# EAGLE design arm (EAGLE 5.08)
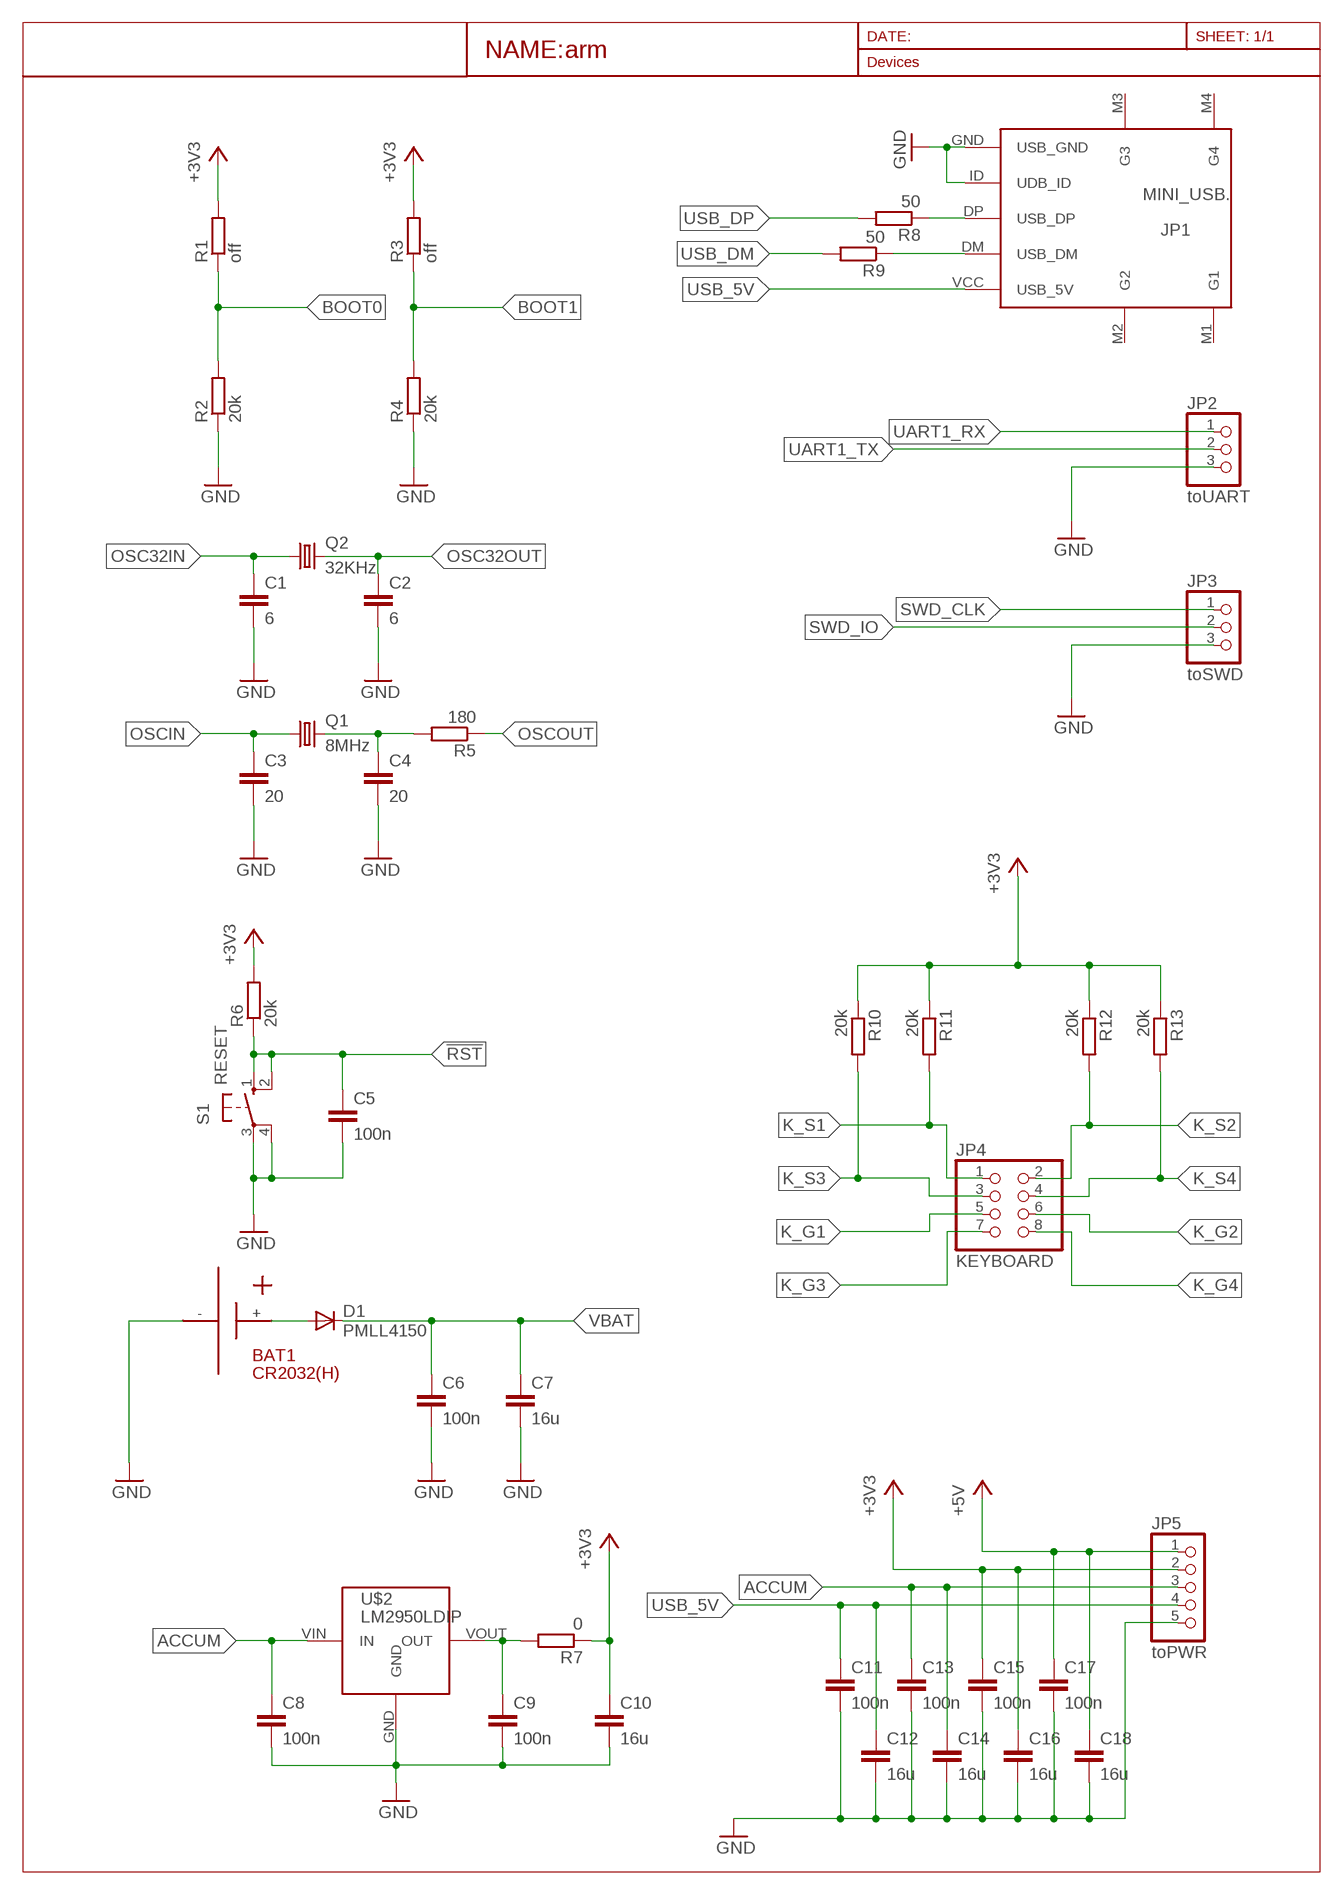
[diagram p0: schematic, sheet 1, part 1 of 2]
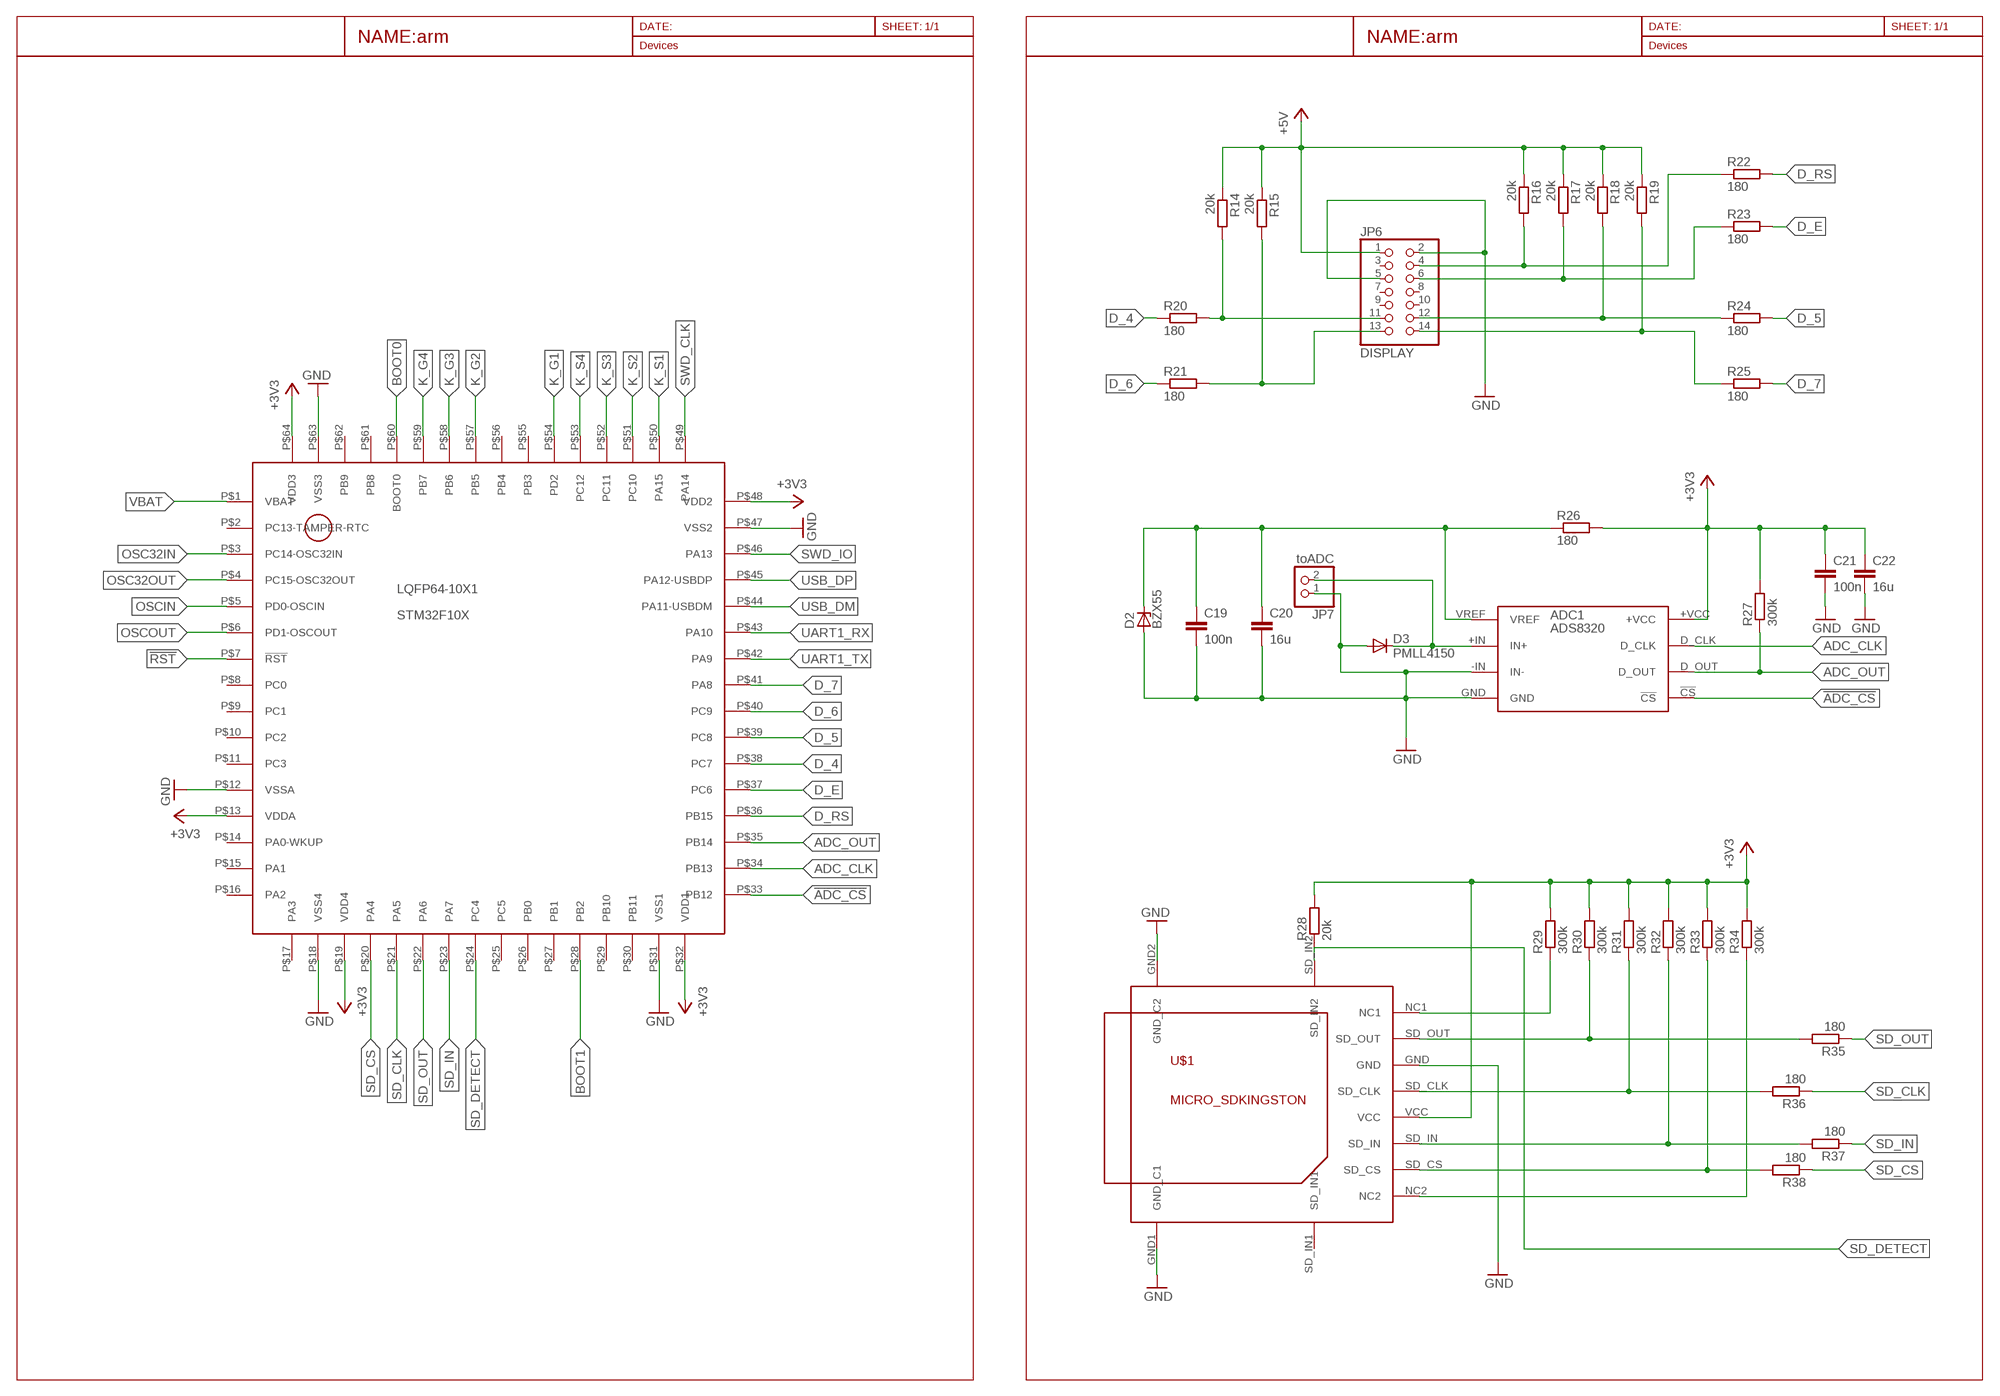
[diagram p1: schematic, sheet 1, part 2 of 2]

## Parts
ADC1  ADS8320  [S-PDSO-G8]
BAT1  CR2032(H)  [BEL/P]
C1  6  C-EUC1206  [C1206]
C2  6  C-EUC1206  [C1206]
C3  20  C-EUC1206  [C1206]
C4  20  C-EUC1206  [C1206]
C5  100n  C-EUC1206  [C1206]
C6  100n  C-EUC1206  [C1206]
C7  16u  C-EU025-024X044  [C025-024X044]
C8  100n  C-EUC1206  [C1206]
C9  100n  C-EUC1206  [C1206]
C10  16u  C-EU025-024X044  [C025-024X044]
C11  100n  C-EUC1206  [C1206]
C12  16u  C-EU025-024X044  [C025-024X044]
C13  100n  C-EUC1206  [C1206]
C14  16u  C-EU025-024X044  [C025-024X044]
C15  100n  C-EUC1206  [C1206]
C16  16u  C-EU025-024X044  [C025-024X044]
C17  100n  C-EUC1206  [C1206]
C18  16u  C-EU025-024X044  [C025-024X044]
C19  100n  C-EUC1206  [C1206]
C20  16u  C-EU025-024X044  [C025-024X044]
C21  100n  C-EUC1206  [C1206]
C22  16u  C-EU025-024X044  [C025-024X044]
D1  PMLL4150  [SOD80C]
D2  BZX55  [DO35Z10]
D3  PMLL4150  [SOD80C]
JP1  MINI_USB.  [32005-201]
JP2  toUART  PINHD-1X3  [1X03]
JP3  toSWD  PINHD-1X3  [1X03]
JP4  KEYBOARD  PINHD-2X4  [2X04]
JP5  toPWR  PINHD-1X5  [1X05]
JP6  DISPLAY  PINHD-2X7  [2X07]
JP7  toADC  PINHD-1X2  [1X02]
LQFP64-10X1  STM32F10X  [LQFP64]
Q1  8MHz  CRYSTALHC49S  [HC49/S]
Q2  32KHz  CRYSTALTC26V  [TC26V]
R1  off  R-EU_R1206  [R1206]
R2  20k  R-EU_R1206  [R1206]
R3  off  R-EU_R1206  [R1206]
R4  20k  R-EU_R1206  [R1206]
R5  180  R-EU_R1206  [R1206]
R6  20k  R-EU_R1206  [R1206]
R7  0  R-EU_R1206  [R1206]
R8  50  R-EU_R1206  [R1206]
R9  50  R-EU_R1206  [R1206]
R10  20k  R-EU_R1206  [R1206]
R11  20k  R-EU_R1206  [R1206]
R12  20k  R-EU_R1206  [R1206]
R13  20k  R-EU_R1206  [R1206]
R14  20k  R-EU_R1206  [R1206]
R15  20k  R-EU_R1206  [R1206]
R16  20k  R-EU_R1206  [R1206]
R17  20k  R-EU_R1206  [R1206]
R18  20k  R-EU_R1206  [R1206]
R19  20k  R-EU_R1206  [R1206]
R20  180  R-EU_R1206  [R1206]
R21  180  R-EU_R1206  [R1206]
R22  180  R-EU_R1206  [R1206]
R23  180  R-EU_R1206  [R1206]
R24  180  R-EU_R1206  [R1206]
R25  180  R-EU_R1206  [R1206]
R26  180  R-EU_R1206  [R1206]
R27  300k  R-EU_R1206  [R1206]
R28  20k  R-EU_R1206  [R1206]
R29  300k  R-EU_R1206  [R1206]
R30  300k  R-EU_R1206  [R1206]
R31  300k  R-EU_R1206  [R1206]
R32  300k  R-EU_R1206  [R1206]
R33  300k  R-EU_R1206  [R1206]
R34  300k  R-EU_R1206  [R1206]
R35  180  R-EU_R1206  [R1206]
R36  180  R-EU_R1206  [R1206]
R37  180  R-EU_R1206  [R1206]
R38  180  R-EU_R1206  [R1206]
S1  RESET  10-XX  [B3F-10XX]
U$1  MICRO_SDKINGSTON  [MICRO_SD_TFCMF20801B0T0]
U$2  LM2950LDIP  [TO-92]

## Nets
!ADC_CS: ADC1.!CS LQFP64-10X1.P$33(PB12)
!RST: C5.1 LQFP64-10X1.P$7(!RST) R6.1 S1.1(S) S1.2(S1)
+3V3: ADC1.+VCC C10.1 C15.1 C16.1 C21.1 C22.1 JP5.2 LQFP64-10X1.P$13(VDDA) LQFP64-10X1.P$19(VDD4) LQFP64-10X1.P$32(VDD1) LQFP64-10X1.P$48(VDD2) LQFP64-10X1.P$64(VDD3) R1.2 R3.2 R6.2 R7.1 R10.1 R11.1 R12.1 R13.1 R26.2 R27.2 R28.2 R29.2 R30.2 R31.2 R32.2 R33.2 R34.2 U$1.VCC
+5V: C17.1 C18.1 JP5.1 JP6.1 R14.1 R15.1 R16.1 R17.1 R18.1 R19.1
ACCUM: C8.1 C13.1 C14.1 JP5.3 U$2.VIN(IN)
ADC_CLK: ADC1.D_CLK LQFP64-10X1.P$34(PB13)
ADC_OUT: ADC1.D_OUT LQFP64-10X1.P$35(PB14) R27.1
BOOT0: LQFP64-10X1.P$60(BOOT0) R1.1 R2.2
BOOT1: LQFP64-10X1.P$28(PB2) R3.1 R4.2
D_4: LQFP64-10X1.P$38(PC7) R20.1
D_5: LQFP64-10X1.P$39(PC8) R24.2
D_6: LQFP64-10X1.P$40(PC9) R21.1
D_7: LQFP64-10X1.P$41(PA8) R25.2
D_E: LQFP64-10X1.P$37(PC6) R23.2
D_RS: LQFP64-10X1.P$36(PB15) R22.2
GND: ADC1.-IN(IN-) ADC1.GND BAT1.- C1.2 C2.2 C3.2 C4.2 C5.2 C6.2 C7.2 C8.2 C9.2 C10.2 C11.2 C12.2 C13.2 C14.2 C15.2 C16.2 C17.2 C18.2 C19.2 C20.2 C21.2 C22.2 D2.A D3.A JP1.GND(USB_GND) JP1.ID(UDB_ID) JP2.3 JP3.3 JP5.5 JP6.2 JP6.5 JP7.1 LQFP64-10X1.P$12(VSSA) LQFP64-10X1.P$18(VSS4) LQFP64-10X1.P$31(VSS1) LQFP64-10X1.P$47(VSS2) LQFP64-10X1.P$63(VSS3) R2.1 R4.1 S1.3(P) S1.4(P1) U$1.GND U$1.GND1(GND_C1) U$1.GND2(GND_C2) U$2.GND
K_G1: JP4.5 LQFP64-10X1.P$54(PD2)
K_G2: JP4.6 LQFP64-10X1.P$57(PB5)
K_G3: JP4.7 LQFP64-10X1.P$58(PB6)
K_G4: JP4.8 LQFP64-10X1.P$59(PB7)
K_S1: JP4.1 LQFP64-10X1.P$50(PA15) R11.2
K_S2: JP4.2 LQFP64-10X1.P$51(PC10) R12.2
K_S3: JP4.3 LQFP64-10X1.P$52(PC11) R10.2
K_S4: JP4.4 LQFP64-10X1.P$53(PC12) R13.2
N$1: JP1.DP(USB_DP) R8.1
N$2: JP1.DM(USB_DM) R9.1
N$3: C9.1 R7.2 U$2.VOUT(OUT)
N$6: JP6.6 R17.2 R23.1
N$7: JP6.4 R16.2 R22.1
N$8: JP6.11 R14.2 R20.2
N$10: ADC1.VREF C19.1 C20.1 D2.C R26.1
N$11: JP6.13 R15.2 R21.2
N$12: JP6.12 R18.2 R24.1
N$13: JP6.14 R19.2 R25.1
N$14: ADC1.+IN(IN+) D3.C JP7.2
N$15: BAT1.+ D1.A
NC1: R29.1 U$1.NC1
NC2: R34.1 U$1.NC2
OSC32IN: C1.1 LQFP64-10X1.P$3(PC14-OSC32IN) Q2.1
OSC32OUT: C2.1 LQFP64-10X1.P$4(PC15-OSC32OUT) Q2.2
OSCIN: C3.1 LQFP64-10X1.P$5(PD0-OSCIN) Q1.1
OSCOU: C4.1 Q1.2 R5.2
OSCOUT: LQFP64-10X1.P$6(PD1-OSCOUT) R5.1
SD_C: R33.1 R38.2 U$1.SD_CS
SD_CL: R31.1 R36.2 U$1.SD_CLK
SD_CLK: LQFP64-10X1.P$21(PA5) R36.1
SD_CS: LQFP64-10X1.P$20(PA4) R38.1
SD_DETECT: LQFP64-10X1.P$24(PC4) R28.1 U$1.SD_IN2
SD_I: R32.1 R37.2 U$1.SD_IN
SD_IN: LQFP64-10X1.P$23(PA7) R37.1
SD_O: R30.1 R35.2 U$1.SD_OUT
SD_OUT: LQFP64-10X1.P$22(PA6) R35.1
SWD_CLK: JP3.1 LQFP64-10X1.P$49(PA14)
SWD_IO: JP3.2 LQFP64-10X1.P$46(PA13)
UART1_RX: JP2.1 LQFP64-10X1.P$43(PA10)
UART1_TX: JP2.2 LQFP64-10X1.P$42(PA9)
USB_5V: C11.1 C12.1 JP1.VCC(USB_5V) JP5.4
USB_DM: LQFP64-10X1.P$44(PA11-USBDM) R9.2
USB_DP: LQFP64-10X1.P$45(PA12-USBDP) R8.2
VBAT: C6.1 C7.1 D1.C LQFP64-10X1.P$1(VBAT)
Unconnected: JP1.M1(G1) JP1.M2(G2) JP1.M3(G3) JP1.M4(G4) JP6.3 JP6.7 JP6.8 JP6.9 JP6.10 LQFP64-10X1.P$2(PC13-TAMPER-RTC) LQFP64-10X1.P$8(PC0) LQFP64-10X1.P$9(PC1) LQFP64-10X1.P$10(PC2) LQFP64-10X1.P$11(PC3) LQFP64-10X1.P$14(PA0-WKUP) LQFP64-10X1.P$15(PA1) LQFP64-10X1.P$16(PA2) LQFP64-10X1.P$17(PA3) LQFP64-10X1.P$25(PC5) LQFP64-10X1.P$26(PB0) LQFP64-10X1.P$27(PB1) LQFP64-10X1.P$29(PB10) LQFP64-10X1.P$30(PB11) LQFP64-10X1.P$55(PB3) LQFP64-10X1.P$56(PB4) LQFP64-10X1.P$61(PB8) LQFP64-10X1.P$62(PB9) U$1.SD_IN1

## Library data of the parts
ADC1 = ADC:ADS8320
BAT1 = connectors:CR2032
C1-C22 = rcl:C-EU: CAPACITOR, European symbol
D1 D3 = diode:PMLL4150: DIODE high speed
D2 = diode:BZX55: Z DIODE
JP1 = connectors:MINI_USB
JP2 JP3 = pinhead:PINHD-1X3: PIN HEADER
JP4 = pinhead:PINHD-2X4: PIN HEADER
JP5 = pinhead:PINHD-1X5: PIN HEADER
JP6 = pinhead:PINHD-2X7: PIN HEADER
JP7 = pinhead:PINHD-1X2: PIN HEADER
LQFP64-10X1 = ARM:STM32F10X
Q1 Q2 = crystal:CRYSTAL: CRYSTAL
R1-R38 = resistor:R-EU_: RESISTOR, European symbol
S1 = switch-omron:10-XX: OMRON SWITCH
U$1 = connectors:MICRO_SD
U$2 = stabil:LM2950L

## Board
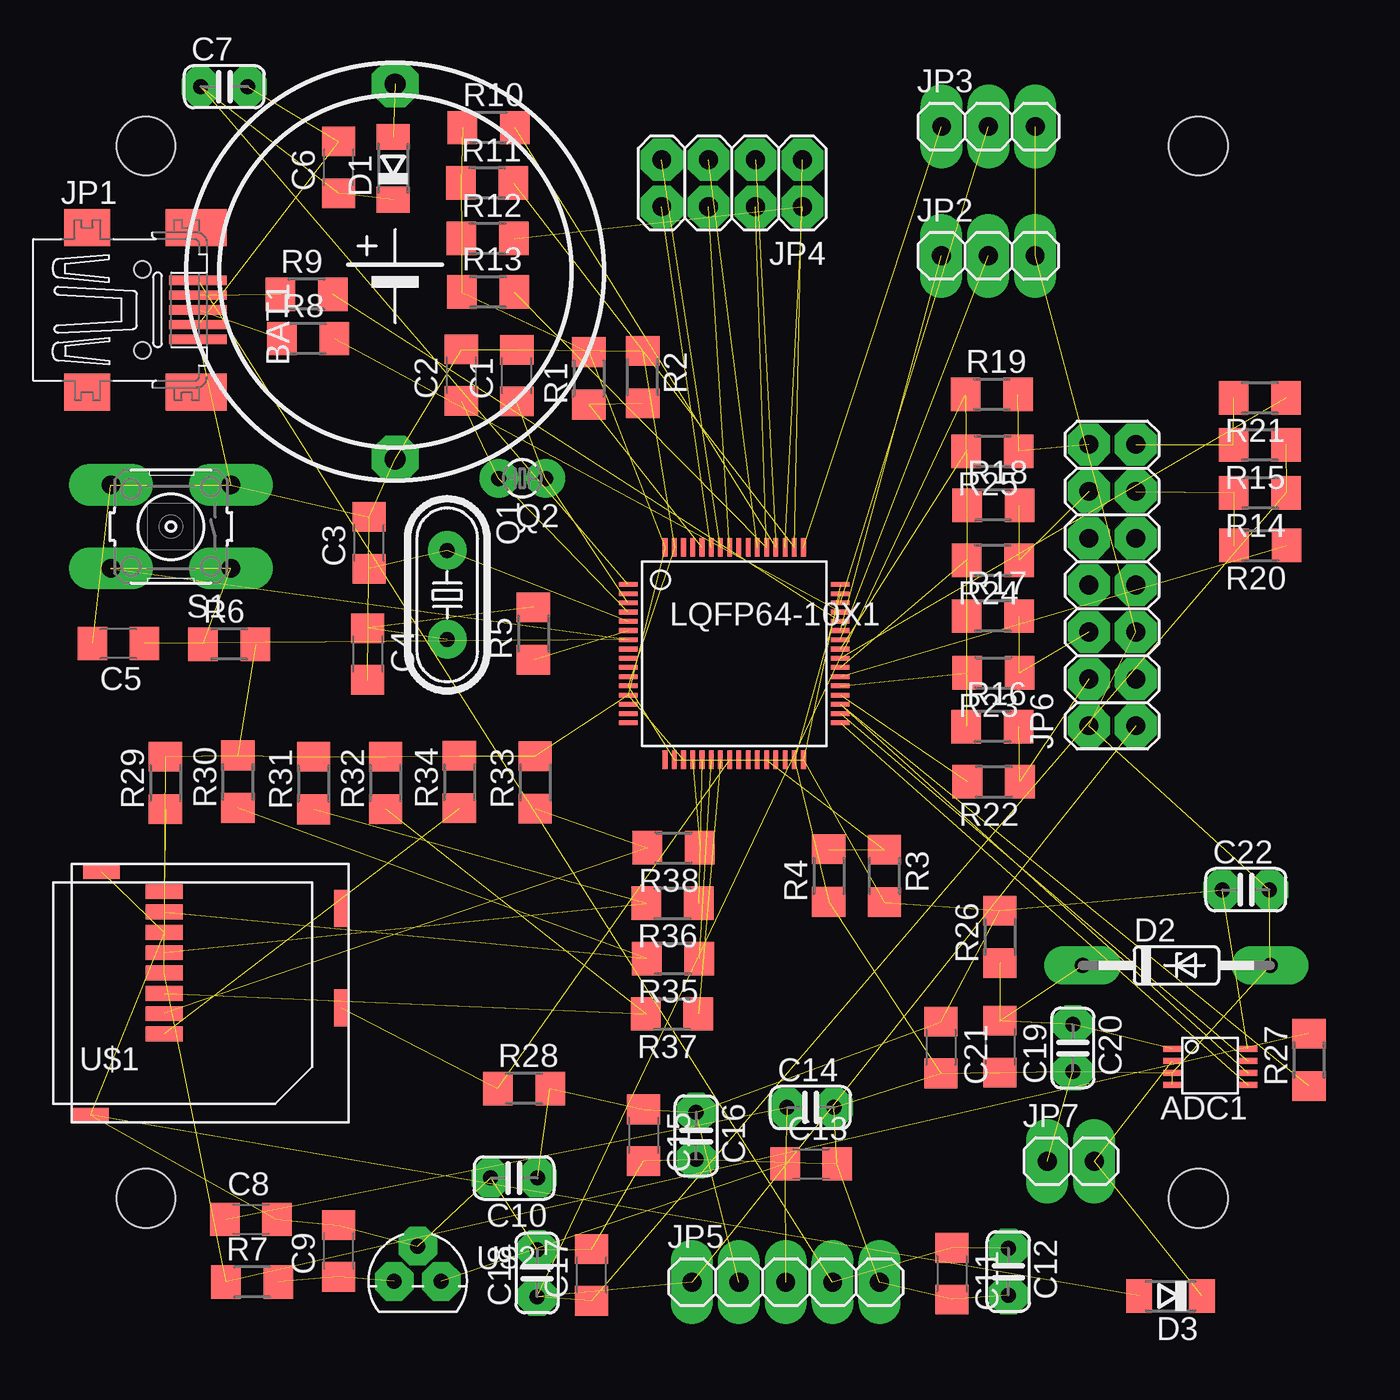
[diagram p2: board, top side]
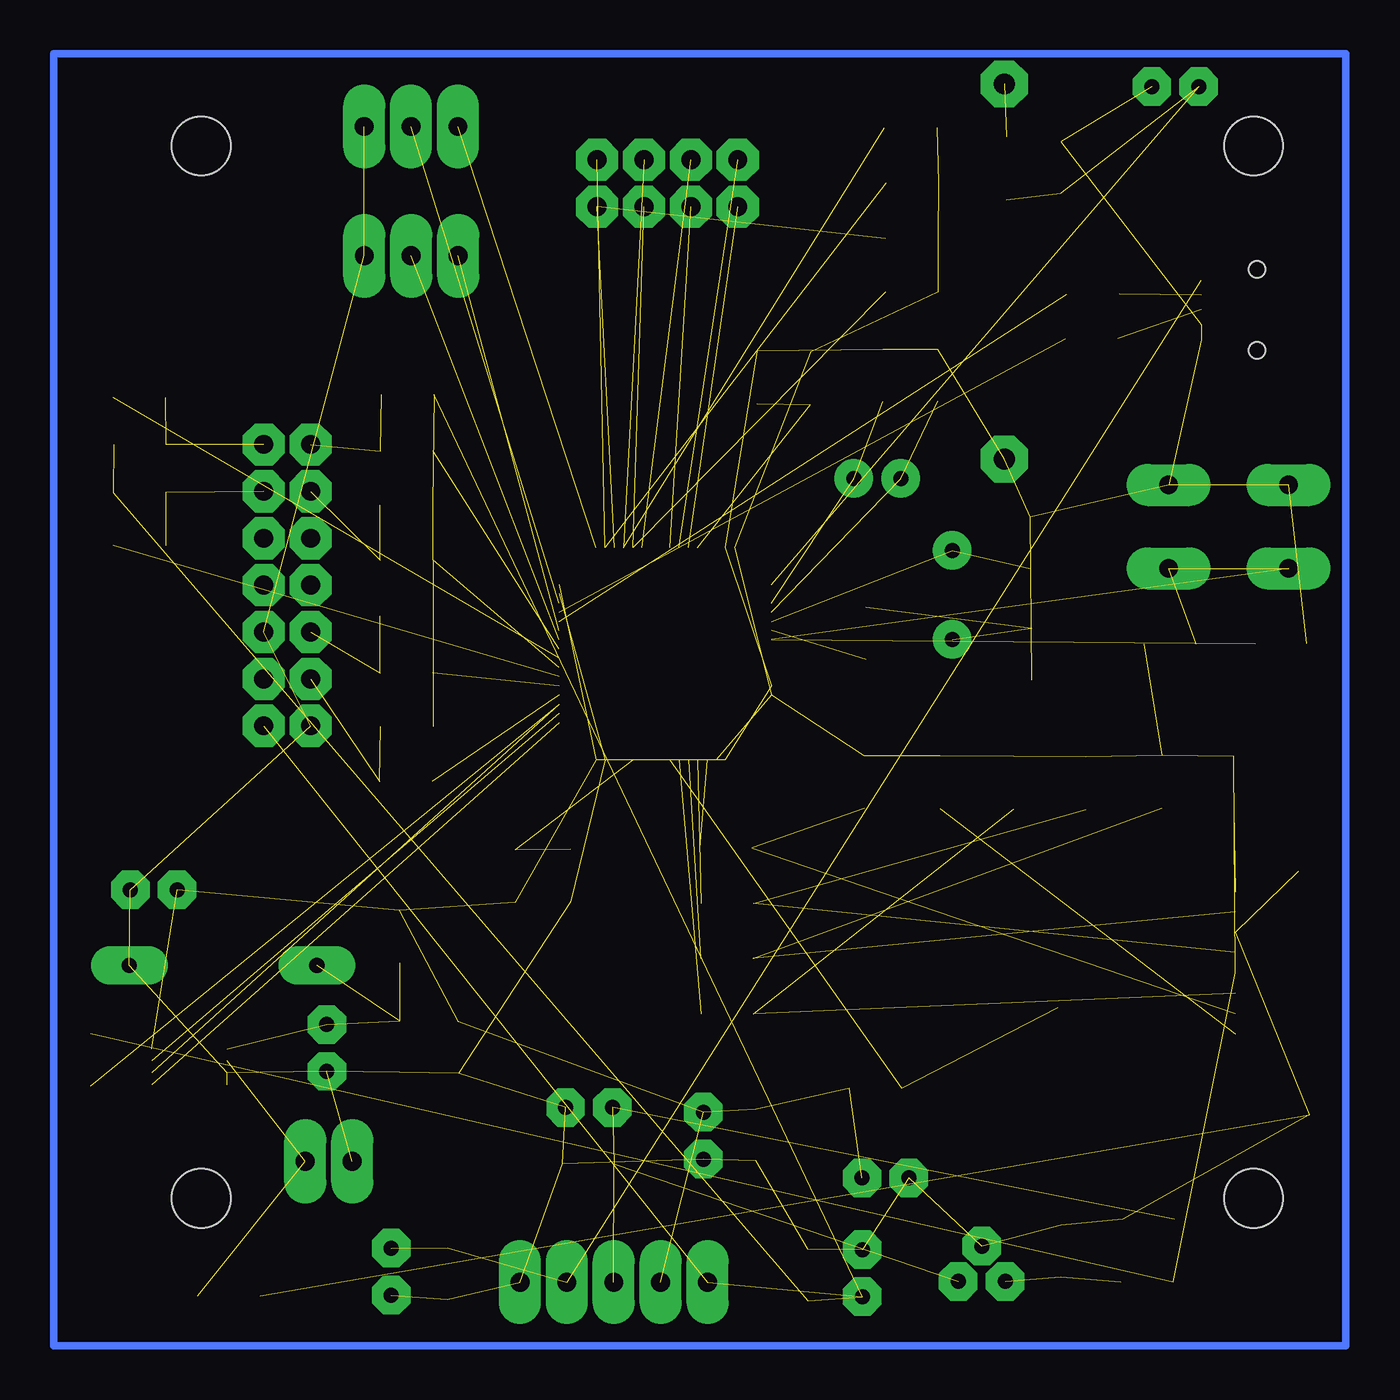
[diagram p3: board, bottom side, seen from below]

No outline drawn. Coordinates in mm, seen from the top.
Copper layers (1*16): Top 0.035mm / dielectric 1.5mm / Bottom 0.035mm
Design rules "default": minimum track width 10mil, minimum drill 32mil, track to track 12mil, track to pad 12mil, pad to pad 12mil, via to via 12mil, smd to smd 8mil, copper to edge 40mil, drill to drill 40mil, minimum pad ring 25mil, minimum via ring 12mil, stop-mask expansion 4mil, vias tented up to drill 0mil, thermal gap 10mil
Holes 3.2 mm at 5,8 5,65 62,65 62,8

### Footprints (pad centres in the part's own frame; a part is rotated, then mirrored left to right if it is on the bottom)
S-PDSO-G8 = smd 1 x 0.305: !CS 3.55,-2.55; +IN -0.55,-1.25; +VCC 3.55,-0.6; -IN -0.55,-1.9; D_CLK 3.55,-1.25; D_OUT 3.55,-1.9; GND -0.55,-2.55; VREF -0.55,-0.6
BEL/P = drill 1.118 pad 2.54 octagon: + 10.16,0; - -10.16,0
C1206 = smd 1.6 x 1.8: 1 -1.4,0; 2 1.4,0
C025-024X044 = drill 0.813 octagon: 1 -1.27,0; 2 1.27,0
SOD80C = smd 1.4 x 1.8: A 1.7,0; C -1.7,0
DO35Z10 = drill 0.813 long: A 5.08,0; C -5.08,0
32005-201 = smd 3.1 x 0.5: DM 3,0.8; DP 3,0; GND 3,-1.6; ID 3,-0.8; VCC 3,1.6 | smd 2.5 x 2: M1 -3,-4.45; M2 -3,4.45 | smd 3.3 x 2: M3 2.9,4.45; M4 2.9,-4.45 | hole 0.9: 0,2.2; 0,-2.2
1X03 = drill 1.016 long: 1 -2.54,0; 2 0,0; 3 2.54,0
2X04 = drill 1.016 octagon: 1 -3.81,-1.27; 2 -3.81,1.27; 3 -1.27,-1.27; 4 -1.27,1.27; 5 1.27,-1.27; 6 1.27,1.27; 7 3.81,-1.27; 8 3.81,1.27
1X05 = drill 1.016 long: 1 -5.08,0; 2 -2.54,0; 3 0,0; 4 2.54,0; 5 5.08,0
2X07 = drill 1.016 octagon: 1 -7.62,-1.27; 2 -7.62,1.27; 3 -5.08,-1.27; 4 -5.08,1.27; 5 -2.54,-1.27; 6 -2.54,1.27; 7 0,-1.27; 8 0,1.27; 9 2.54,-1.27; 10 2.54,1.27; 11 5.08,-1.27; 12 5.08,1.27; 13 7.62,-1.27; 14 7.62,1.27
1X02 = drill 1.016 long: 1 -1.27,0; 2 1.27,0
LQFP64 = smd 1 x 0.25: P$1 -1.25,-0.75; P$2 -1.25,-1.25; P$3 -1.25,-1.75; P$4 -1.25,-2.25; P$5 -1.25,-2.75; P$6 -1.25,-3.25; P$7 -1.25,-3.75; P$8 -1.25,-4.25; P$9 -1.25,-4.75; P$10 -1.25,-5.25; P$11 -1.25,-5.75; P$12 -1.25,-6.25; P$13 -1.25,-6.75; P$14 -1.25,-7.25; P$15 -1.25,-7.75; P$16 -1.25,-8.25; P$33 10.25,-8.25; P$34 10.25,-7.75; P$35 10.25,-7.25; P$36 10.25,-6.75; P$37 10.25,-6.25; P$38 10.25,-5.75; P$39 10.25,-5.25; P$40 10.25,-4.75; P$41 10.25,-4.25; P$42 10.25,-3.75; P$43 10.25,-3.25; P$44 10.25,-2.75; P$45 10.25,-2.25; P$46 10.25,-1.75; P$47 10.25,-1.25; P$48 10.25,-0.75 | smd 0.25 x 1: P$17 0.75,-10.25; P$18 1.25,-10.25; P$19 1.75,-10.25; P$20 2.25,-10.25; P$21 2.75,-10.25; P$22 3.25,-10.25; P$23 3.75,-10.25; P$24 4.25,-10.25; P$25 4.75,-10.25; P$26 5.25,-10.25; P$27 5.75,-10.25; P$28 6.25,-10.25; P$29 6.75,-10.25; P$30 7.25,-10.25; P$31 7.75,-10.25; P$32 8.25,-10.25; P$49 8.25,1.25; P$50 7.75,1.25; P$51 7.25,1.25; P$52 6.75,1.25; P$53 6.25,1.25; P$54 5.75,1.25; P$55 5.25,1.25; P$56 4.75,1.25; P$57 4.25,1.25; P$58 3.75,1.25; P$59 3.25,1.25; P$60 2.75,1.25; P$61 2.25,1.25; P$62 1.75,1.25; P$63 1.25,1.25; P$64 0.75,1.25
HC49/S = drill 0.813 round: 1 -2.413,0; 2 2.413,0
TC26V = drill 0.813 round: 1 -1.27,0; 2 1.27,0
R1206 = smd 1.6 x 1.803: 1 -1.422,0; 2 1.422,0
B3F-10XX = drill 1.016 long: 1 -3.251,2.261; 2 3.251,2.261; 3 -3.251,-2.261; 4 3.251,-2.261
MICRO_SD_TFCMF20801B0T0 = smd 2 x 0.8: GND 3.3,-1.3; GND1 -0.1,2; GND2 -0.7,-11.2; NC1 3.3,0.9; NC2 3.3,-6.8; SD_CLK 3.3,-2.4; SD_CS 3.3,-5.7; SD_IN 3.3,-4.6; SD_OUT 3.3,-0.2; VCC 3.3,-3.5 | smd 0.8 x 2: SD_IN1 12.9,0; SD_IN2 12.9,-5.4
TO-92 = drill 0.813 octagon: GND 0,1.905; VIN 1.27,0; VOUT -1.27,0

### Placement (x,y rotation side)
ADC1  61.15,16.69 0 top
BAT1  18.5,58.2 90 top
C1  25.09,52.56 90 top
C2  22.09,52.58 90 top
C3  17.09,43.5 90 top
C4  17.01,37.48 270 top
C5  3.51,38.04 180 top
C6  15.44,63.84 90 top
C7  9.24,68.21 0 top
C8  10.69,6.86 0 top
C9  15.44,5.14 90 top
C10  24.94,9.09 180 top
C11  48.66,3.91 270 top
C12  51.71,4.02 270 top
C13  41.04,9.86 0 top
C14  41,12.91 0 top
C15  31.96,11.41 270 top
C16  34.81,11.38 270 top
C17  29.14,3.84 90 top
C18  26.19,3.94 90 top
C19  51.26,16.21 270 top
C20  55.21,16.14 270 top
C21  48.06,16.16 270 top
C22  64.58,24.71 0 top
D1  18.39,63.79 90 top
D2  60.82,20.61 0 top
D3  60.5,2.7 180 top
JP1  4.82,56.12 0 top
JP2  50.63,59.05 0 top
JP3  50.64,66.05 0 top
JP4  36.75,62.98 180 top
JP5  39.66,3.45 0 top
JP6  57.35,41.21 90 top
JP7  55.1,10 0 top
LQFP64-10X1  32.37,42 0 top
Q1  21.32,40.68 270 top
Q2  25.38,46.99 180 top
R1  28.99,52.41 90 top
R2  31.91,52.47 270 top
R3  45.01,25.45 270 top
R4  41.99,25.47 90 top
R5  25.99,38.59 90 top
R6  9.51,38.01 0 top
R7  10.76,3.46 0 top
R8  13.78,54.56 0 top
R9  13.7,56.96 0 top
R10  23.57,65.99 0 top
R11  23.49,62.99 0 top
R12  23.51,59.99 0 top
R13  23.53,57.09 0 top
R14  65.35,46.21 180 top
R15  65.33,48.81 180 top
R16  50.86,33.54 0 top
R17  50.88,39.54 0 top
R18  50.9,45.54 0 top
R19  50.82,51.54 0 top
R20  65.36,43.36 180 top
R21  65.34,51.36 180 top
R22  50.92,30.56 180 top
R23  50.9,36.46 180 top
R24  50.88,42.56 180 top
R25  50.86,48.46 180 top
R26  51.26,22.16 90 top
R27  68,15.5 90 top
R28  25.48,13.94 0 top
R29  6.06,30.5 90 top
R30  9.98,30.56 90 top
R31  14.08,30.48 90 top
R32  17.98,30.5 90 top
R33  26.08,30.52 90 top
R34  21.98,30.54 90 top
R35  33.54,20.98 180 top
R36  33.52,23.98 180 top
R37  33.5,17.98 180 top
R38  33.58,26.98 180 top
S1  6.35,44.38 180 top
U$1  2.69,23.7 0 top
U$2  19.72,3.49 0 top

### Tracks (layer width: path | path; a pad name or v marks a point on that pad's centre or on a via)
!ADC_CS  (1 unrouted)
!RST  (4 unrouted)
+3V3  (29 unrouted)
+5V  (9 unrouted)
ACCUM  (4 unrouted)
ADC_CLK  (1 unrouted)
ADC_OUT  (2 unrouted)
BOOT0  (2 unrouted)
BOOT1  (2 unrouted)
D_4  (1 unrouted)
D_5  (1 unrouted)
D_6  (1 unrouted)
D_7  (1 unrouted)
D_E  (1 unrouted)
D_RS  (1 unrouted)
GND  (47 unrouted)
K_G1  (1 unrouted)
K_G2  (1 unrouted)
K_G3  (1 unrouted)
K_G4  (1 unrouted)
K_S1  (2 unrouted)
K_S2  (2 unrouted)
K_S3  (2 unrouted)
K_S4  (2 unrouted)
N$1  (1 unrouted)
N$2  (1 unrouted)
N$3  (2 unrouted)
N$4
  Bottom 0.406: 0,0 70,0 70,70 0,70 0,0
N$6  (2 unrouted)
N$7  (2 unrouted)
N$8  (2 unrouted)
N$10  (4 unrouted)
N$11  (2 unrouted)
N$12  (2 unrouted)
N$13  (2 unrouted)
N$14  (2 unrouted)
N$15  (1 unrouted)
NC1  (1 unrouted)
NC2  (1 unrouted)
OSC32IN  (2 unrouted)
OSC32OUT  (2 unrouted)
OSCIN  (2 unrouted)
OSCOU  (2 unrouted)
OSCOUT  (1 unrouted)
SD_C  (2 unrouted)
SD_CL  (2 unrouted)
SD_CLK  (1 unrouted)
SD_CS  (1 unrouted)
SD_DETECT  (2 unrouted)
SD_I  (2 unrouted)
SD_IN  (1 unrouted)
SD_O  (2 unrouted)
SD_OUT  (1 unrouted)
SWD_CLK  (1 unrouted)
SWD_IO  (1 unrouted)
UART1_RX  (1 unrouted)
UART1_TX  (1 unrouted)
USB_5V  (3 unrouted)
USB_DM  (1 unrouted)
USB_DP  (1 unrouted)
VBAT  (3 unrouted)